# Altium schematic sheet MCU.SchDoc
size A; DocumentNumber: 2; SheetNumber: 2; SheetTotal: 6
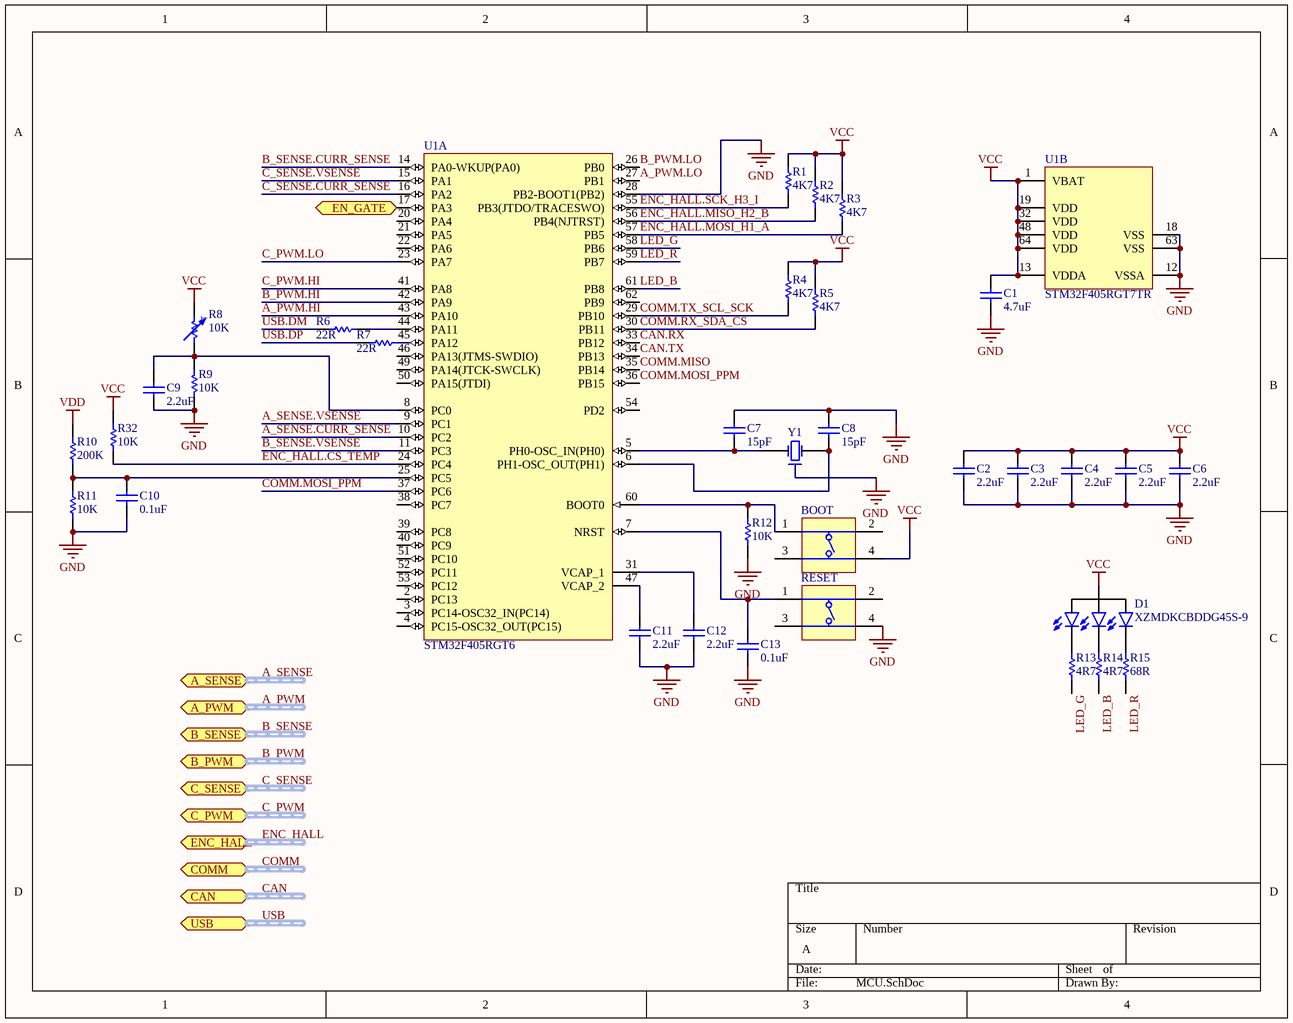
[diagram p0: MCU.SchDoc]

## Parts
(Parts that share a designator on the sheet are numbered #1, #2 ... from top to bottom, then left to right.)
BOOT  (no value)  [SWITCH]
C1  value 4.7uF  [C0402[1005X55]]  (hidden comment: 4.7uF 6.3V 0402)
C2  value 2.2uF  [C0402[1005X55]]  (hidden comment: 2.2uF 6.3V 0402)
C3  value 2.2uF  [C0402[1005X55]]  (hidden comment: 2.2uF 6.3V 0402)
C4  value 2.2uF  [C0402[1005X55]]  (hidden comment: 2.2uF 6.3V 0402)
C5  value 2.2uF  [C0402[1005X55]]  (hidden comment: 2.2uF 6.3V 0402)
C6  value 2.2uF  [C0402[1005X55]]  (hidden comment: 2.2uF 6.3V 0402)
C7  value 15pF  [C0402[1005X55]]  (hidden comment: 15pF 50V 0402)
C8  value 15pF  [C0402[1005X55]]  (hidden comment: 15pF 50V 0402)
C9  value 2.2uF  [C0402[1005X55]]  (hidden comment: 2.2uF 6.3V 0402)
C10  value 0.1uF  [C0402[1005X55]]  (hidden comment: 0.1uF 6.3V 0402)
C11  value 2.2uF  [C0402[1005X55]]  (hidden comment: 2.2uF 6.3V 0402)
C12  value 2.2uF  [C0402[1005X55]]  (hidden comment: 2.2uF 6.3V 0402)
C13  value 0.1uF  [C0402[1005X55]]  (hidden comment: 0.1uF 6.3V 0402)
D1  XZMDKCBDDG45S-9  [XZMDKCBDDG45S-9]
R1  value 4K7  [R0402[1005]]  (hidden comment: 4K7 1% 0402)
R2  value 4K7  [R0402[1005]]  (hidden comment: 4K7 1% 0402)
R3  value 4K7  [R0402[1005]]  (hidden comment: 4K7 1% 0402)
R4  value 4K7  [R0402[1005]]  (hidden comment: 4K7 1% 0402)
R5  value 4K7  [R0402[1005]]  (hidden comment: 4K7 1% 0402)
R6  value 22R  [R0402[1005]]  (hidden comment: 22R 1% 0402)
R7  value 22R  [R0402[1005]]  (hidden comment: 22R 1% 0402)
R8  value 10K  [R0402[1005]]  (hidden comment: 10K 0.5% 0402)
R9  value 10K  [R0402[1005]]  (hidden comment: 10K 1% 0402)
R10  value 200K  [R0402[1005]]  (hidden comment: 200K 1% 0402)
R11  value 10K  [R0402[1005]]  (hidden comment: 10K 1% 0402)
R12  value 10K  [R0402[1005]]  (hidden comment: 10K 1% 0402)
R13  value 4R7  [R0402[1005]]  (hidden comment: 4R7 1% 0402)
R14  value 4R7  [R0402[1005]]  (hidden comment: 4R7 1% 0402)
R15  value 68R  [R0402[1005]]  (hidden comment: 68R 1% 0402)
R32  value 10K  [R0402[1005]]  (hidden comment: 10K 1% 0402)
RESET  (no value)  [SWITCH]
U1#1  STM32F405RGT6  [STM-LQFP64_L]  (part A of 2)
U1#2  STM32F405RGT7TR  [STM-LQFP64_V]  (part B of 2)
Y1  (no value)  [ABRA-ABM3B-4_V]

## Ports
A_PWM (harness Phase Input), A_SENSE (harness Phase Sense), B_PWM (harness Phase Input), B_SENSE (harness Phase Sense), C_PWM (harness Phase Input), C_SENSE (harness Phase Sense), CAN (harness CAN Input), COMM (harness Comm), EN_GATE (out), ENC_HALL (harness Encoder/Hall), USB (harness USB)

## Nets
GND: C1.1 C2.1 C3.1 C4.1 C5.1 C6.1 C7.2 C8.2 C9.1 C10.1 C11.1 C12.1 C13.1 R9.1 R11.1 R12.1 RESET.4(T3) U1#1.28(PB2-BOOT1(PB2)) U1#2.12(VSSA) U1#2.18(VSS) U1#2.63(VSS) Y1.2
VCC: BOOT.4(T3) C1.2 C2.2 C3.2 C4.2 C5.2 C6.2 D1.2(A) R1.2 R2.2 R3.2 R4.2 R5.2 R8.2 R32.2 U1#2.1(VBAT) U1#2.13(VDDA) U1#2.19(VDD) U1#2.32(VDD) U1#2.48(VDD) U1#2.64(VDD)
VDD: R10.1
A_PWM.HI: U1#1.43(PA10)
A_PWM.LO: U1#1.27(PB1)
A_SENSE.CURR_SENSE: U1#1.10(PC2)
A_SENSE.VSENSE: U1#1.9(PC1)
B_PWM.HI: U1#1.42(PA9)
B_PWM.LO: U1#1.26(PB0)
B_SENSE.CURR_SENSE: U1#1.14(PA0-WKUP(PA0))
B_SENSE.VSENSE: U1#1.11(PC3)
C_PWM.HI: U1#1.41(PA8)
C_PWM.LO: U1#1.23(PA7)
C_SENSE.CURR_SENSE: U1#1.16(PA2)
C_SENSE.VSENSE: U1#1.15(PA1)
CAN.RX: U1#1.33(PB12)
CAN.TX: U1#1.34(PB13)
COMM.MISO: U1#1.35(PB14)
COMM.MOSI_PPM: U1#1.36(PB15) U1#1.37(PC6)
COMM.RX_SDA_CS: R5.1 U1#1.30(PB11)
COMM.TX_SCL_SCK: R4.1 U1#1.29(PB10)
EN_GATE: U1#1.17(PA3) ; port EN_GATE
ENC_HALL.CS_TEMP: R32.1 U1#1.24(PC4)
ENC_HALL.MISO_H2_B: R2.1 U1#1.56(PB4(NJTRST))
ENC_HALL.MOSI_H1_A: R3.1 U1#1.57(PB5)
ENC_HALL.SCK_H3_I: R1.1 U1#1.55(PB3(JTDO/TRACESWO))
LED_B: R14.1 U1#1.61(PB8)
LED_G: R13.1 U1#1.58(PB6)
LED_R: R15.1 U1#1.59(PB7)
USB.DM: R6.1
USB.DP: R7.1
NetBOOT_1: BOOT.1(T1) R12.2 U1#1.60(BOOT0)
NetC7_1: C7.1 U1#1.5(PH0-OSC_IN(PH0)) Y1.3(X2)
NetC8_1: C8.1 U1#1.6(PH1-OSC_OUT(PH1)) Y1.1(X1)
NetC9_2: C9.2 R8.1 R9.2 U1#1.8(PC0)
NetC10_2: C10.2 R10.2 R11.2 U1#1.25(PC5)
NetC11_2: C11.2 U1#1.47(VCAP_2)
NetC12_2: C12.2 U1#1.31(VCAP_1)
NetC13_2: C13.2 RESET.1(T1) U1#1.7(NRST)
NetD1_1: D1.1(K_Red) R15.2
NetD1_3: D1.3(K_Blue) R14.2
NetD1_4: D1.4(K_Green) R13.2
NetR6_2: R6.2 U1#1.44(PA11)
NetR7_2: R7.2 U1#1.45(PA12)

Not connected (* = marked no-connect by the designer): BOOT 2(T2) 3(T3); RESET 2(T2) 3(T3); U1#1 2(PC13) 3(PC14-OSC32_IN(PC14)) 4(PC15-OSC32_OUT(PC15)) 20(PA4) 21(PA5) 22(PA6) 38(PC7) 39(PC8) 40(PC9) 46(PA13(JTMS-SWDIO)) 49(PA14(JTCK-SWCLK)) 50(PA15(JTDI)) 51(PC10) 52(PC11) 53(PC12) 54(PD2) 62(PB9)

## Buses and harness runs
harness A_PWM = port A_PWM
harness A_SENSE = port A_SENSE
harness B_PWM = port B_PWM
harness B_SENSE = port B_SENSE
harness C_PWM = port C_PWM
harness C_SENSE = port C_SENSE
harness CAN = port CAN
harness COMM = port COMM
harness ENC_HALL = port ENC_HALL
harness USB = port USB

## Notes on the sheet
- (in symbol NTC_10K_0402_0.5%) T

## Library data of the parts
BOOT RESET = DIPT-DTSM-6: Switch, SPNO Push Button SMD; Manufacturer: C&K Components; PartNumber: PTS810 SJM 250 SMTR LFS; Packing Type: Tape&Reel; Mechanical Life: 200,000 cycles; ComponentLink2URL: http://www.dip.com.tw/Products_tact.htm; ComponentLink1URL: http://www.dip.com.tw/; ComponentLink3URL: http://www.dip.com.tw/PDF/pro_tact/DTSM_G_-6_2_-V.pdf; PackageDescription: Switch, Surface Mount, 4 Leads, Body 4.6x2.8mm, Height 1.9mm; ComponentLink2Description: Datasheet; ComponentLink3Description: Package Specification; ComponentLink1Description: Manufacturer URL; PackageReference: PTS810; Mounting Technology: Surface Mount
C1 = CAP_4.7uF_6.3V_0402_20%: 4.7uF 6.3V 20% 0402 (1005 Metric); PartNumber: GRM155R60J475ME47D; Manufacturer: Murata; Tolerance: 20%; Mounting Technology: Surface Mount; PackageReference: 0402; PackageDescription: 0402 (1005 Metric); Voltage: 6.3V
C2-C6 C9 C11 C12 = CAP_2.2uF_6.3V_0402_20%: 2.2uF 6.3V 20% 0402 (1005 Metric); PartNumber: GRM155R60J225ME15D; Manufacturer: Murata; Tolerance: 20%; Mounting Technology: Surface Mount; PackageReference: 0402; PackageDescription: 0402 (1005 Metric); Voltage: 6.3V
C7 C8 = CAP_15pF_50V_0402_5%: 15pF 50V 5% 0402 (1005 Metric); PartNumber: GRM1555C1H150JA01D; Manufacturer: Murata; Tolerance: 5%; Mounting Technology: Surface Mount; PackageReference: 0402; PackageDescription: 0402 (1005 Metric); Voltage: 50V
C10 C13 = CAP_0.1uF_6.3V_0402_10%: 0.1uF 6.3V 10% 0402 (1005 Metric); PartNumber: GRM155R70J104KA01D; Manufacturer: Murata; Tolerance: 10%; Mounting Technology: Surface Mount; PackageReference: 0402; PackageDescription: 0402 (1005 Metric); Voltage: 6.3V
D1 = XZMDKCBDDG45S-9: Manufacturer: SunLED; PartNumber: XZMDKCBDDG45S-9; PackageReference: 4-PLCC; Mounting Technology: Surface Mount; PackageDescription: 4-SMD, Gull Wing,  3.20mm L x 2.80mm W
R1-R5 = RES_4K7_0402_1%: 4K7 0.063W 1% 0402 (1005 Metric); Manufacturer: KOA Speer; PartNumber: RK73H1ETTP4701F; Tolerance: 1%; Power: 0.063W; Mounting Technology: Surface Mount; PackageReference: 0402; PackageDescription: 0402 (1005 Metric); ComponentLink1Description: Datasheet; ComponentLink1URL: http://www.koaspeer.com/catimages/Products/RK73H/RK73H.pdf
R6 R7 = RES_22R_0402_1%: 22R 0.063W 1% 0402 (1005 Metric); Manufacturer: KOA Speer; PartNumber: RK73H1ETTP22R0F; Power: 0.063W; Tolerance: 1%; Mounting Technology: Surface Mount; PackageReference: 0402; PackageDescription: 0402 (1005 Metric); ComponentLink1Description: Datasheet; ComponentLink1URL: http://www.koaspeer.com/catimages/Products/RK73H/RK73H.pdf
R8 = NTC_10K_0402_0.5%: NTC 10K 0.5% 0402 (1005 Metric); PartNumber: NCP15XH103D03RC; Manufacturer: Murata; Power: 0.1W; Tolerance: 0.5%; Mounting Technology: Surface Mount; PackageReference: 0402; PackageDescription: 0402 (1005 Metric)
R9 R11 R12 R32 = RES_10K_0402_1%: 10K 0.063W 1% 0402 (1005 Metric); Manufacturer: KOA Speer; PartNumber: RK73H1ETTP1002F; Tolerance: 1%; Power: 0.063W; Mounting Technology: Surface Mount; PackageReference: 0402; PackageDescription: 0402 (1005 Metric); ComponentLink1Description: Datasheet; ComponentLink1URL: http://www.koaspeer.com/catimages/Products/RK73H/RK73H.pdf
R10 = RES_200K_0402_1%: 200K 0.063W 1% 0402 (1005 Metric); Manufacturer: KOA Speer; PartNumber: RK73H1ETTP2003F; Tolerance: 1%; Power: 0.063W; Mounting Technology: Surface Mount; PackageReference: 0402; PackageDescription: 0402 (1005 Metric); ComponentLink1Description: Datasheet; ComponentLink1URL: http://www.koaspeer.com/catimages/Products/RK73H/RK73H.pdf
R13 R14 = RES_4R7_0402_1%: 4R7 0.063W 1% 0402 (1005 Metric); Manufacturer: KOA Speer; PartNumber: RK73H1ETTP4R70F; Power: 0.063W; Tolerance: 1%; Mounting Technology: Surface Mount; PackageReference: 0402; PackageDescription: 0402 (1005 Metric); ComponentLink1Description: Datasheet; ComponentLink1URL: http://www.koaspeer.com/catimages/Products/RK73H/RK73H.pdf
R15 = RES_68R_0402_1%: 68R 0.063W 1% 0402 (1005 Metric); Manufacturer: KOA Speer; PartNumber: RK73H1ETTP68R0F; Tolerance: 1%; Power: 0.063W; Mounting Technology: Surface Mount; PackageReference: 0402; PackageDescription: 0402 (1005 Metric); ComponentLink1Description: Datasheet; ComponentLink1URL: http://www.koaspeer.com/catimages/Products/RK73H/RK73H.pdf
U1#1 U1#2 = CMP-0243-00089-2: ARM Cortex-M4 32-bit MCU+FPU, 210 DMIPS, 1024 kB Flash, 192 kB Internal RAM, 51 I/Os, 64-pin LQFP, -40 to 105 degC, Tape and Reel; Manufacturer: STMicroelectronics; FLASH Size (Prog) (kB): 1024; Supply Voltage(Vcc) max (V): 3.6; Internal RAM Size (kB): 192; Supply Voltage(Vcc) min (V): 1.8; Operating Frequency(F) (Processor speed) (MHz): 168; D/A Converter: 2x12-bit; I/Os (High Current): 51; ComponentLink2Description: Datasheet; Core: ARM Cortex-M4; PackageVersion: Rev. 4, 06/2013; ComponentLink1URL: http://www.st.com/web/en/home.html; PackageReference: LQFP64; Mounting Technology: Surface Mount; ComponentLink1Description: Manufacturer URL; PackageDescription: 64-Pin Low Profile Quad Flat Package, 10 x 10 mm Body, 0.5 mm Pitch; ComponentLink3Description: Package Specification; ComponentLink2URL: http://www.st.com/st-web-ui/static/active/en/resource/technical/document/datasheet/DM00037051.pdf; ComponentLink3URL: http://www.st.com/st-web-ui/static/active/en/resource/technical/document/datasheet/DM00037051.pdf; Packing: Tape and Reel; DatasheetVersion: Rev. 4; PartId: 1
  U1#1: PartNumber: STM32F405RGT6
  U1#2: PartNumber: STM32F405RGT7TR
Y1 = ABRA-ABM3B-4: PartNumber: ABM3B-8.000MHZ-10-1UT; Manufacturer: ABRACON; Mounting Technology: Surface Mount; PackageReference: 2012; PackageDescription: 2012 (5032 metric)